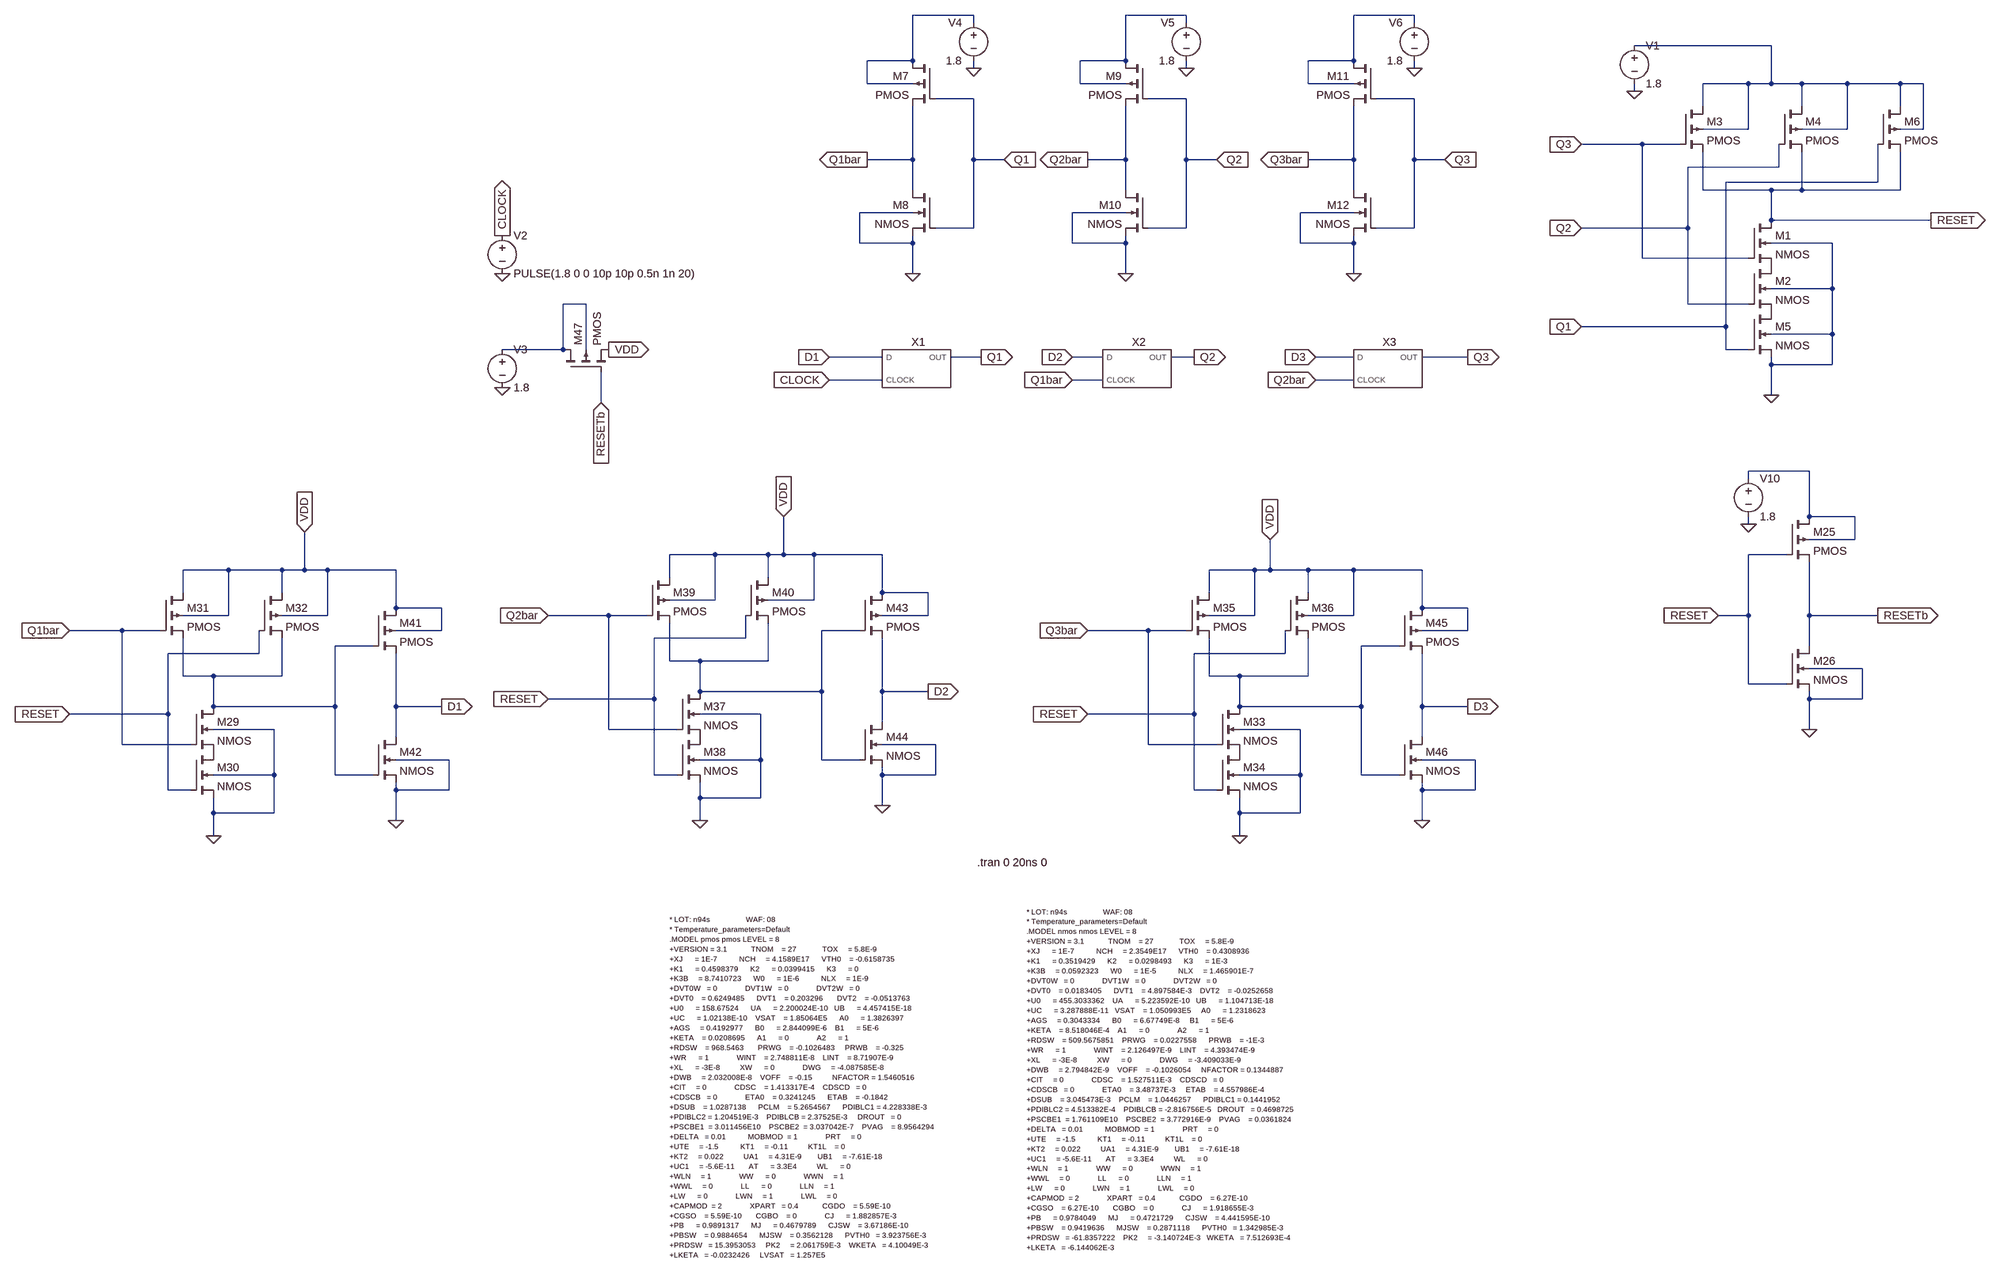
[diagram p0: schematic Mod5_Counter3.asc]
Mod5_Counter3.asc, the LTspice schematic file:
Version 4
SHEET 1 2608 2384
WIRE 16 -208 -112 -208
WIRE 464 -208 336 -208
WIRE 944 -208 816 -208
WIRE 16 -192 16 -208
WIRE 464 -192 464 -208
WIRE 944 -192 944 -208
WIRE 1792 -144 1504 -144
WIRE -112 -112 -112 -208
WIRE -112 -112 -208 -112
WIRE 336 -112 336 -208
WIRE 336 -112 240 -112
WIRE 816 -112 816 -208
WIRE 816 -112 720 -112
WIRE 16 -96 16 -112
WIRE 464 -96 464 -112
WIRE 944 -96 944 -112
WIRE -208 -64 -208 -112
WIRE -112 -64 -208 -64
WIRE 240 -64 240 -112
WIRE 336 -64 240 -64
WIRE 720 -64 720 -112
WIRE 816 -64 720 -64
WIRE 1744 -64 1648 -64
WIRE 1792 -64 1792 -144
WIRE 1792 -64 1744 -64
WIRE 1856 -64 1792 -64
WIRE 1952 -64 1856 -64
WIRE 2064 -64 1952 -64
WIRE 2112 -64 2064 -64
WIRE 1504 -48 1504 -64
WIRE 16 -32 -64 -32
WIRE 464 -32 384 -32
WIRE 944 -32 864 -32
WIRE 1648 -16 1648 -64
WIRE 1856 -16 1856 -64
WIRE 2064 -16 2064 -64
WIRE 1744 32 1744 -64
WIRE 1744 32 1648 32
WIRE 1952 32 1952 -64
WIRE 1952 32 1856 32
WIRE 2112 32 2112 -64
WIRE 2112 32 2064 32
WIRE 1520 64 1392 64
WIRE 1600 64 1520 64
WIRE -112 96 -112 -16
WIRE -112 96 -208 96
WIRE 16 96 16 -32
WIRE 80 96 16 96
WIRE 336 96 336 -16
WIRE 336 96 256 96
WIRE 464 96 464 -32
WIRE 528 96 464 96
WIRE 816 96 816 -16
WIRE 816 96 720 96
WIRE 944 96 944 -32
WIRE 1008 96 944 96
WIRE 1808 112 1808 64
WIRE 1808 112 1616 112
WIRE 2016 144 2016 64
WIRE 2016 144 1696 144
WIRE -112 160 -112 96
WIRE 336 160 336 96
WIRE 816 160 816 96
WIRE 1648 160 1648 80
WIRE 1792 160 1648 160
WIRE 1856 160 1856 80
WIRE 1856 160 1792 160
WIRE 2064 160 2064 80
WIRE 2064 160 1856 160
WIRE -112 208 -224 208
WIRE 336 208 224 208
WIRE 816 208 704 208
WIRE 1792 224 1792 160
WIRE 2128 224 1792 224
WIRE 16 240 16 96
WIRE 16 240 -64 240
WIRE 464 240 464 96
WIRE 464 240 384 240
WIRE 944 240 944 96
WIRE 944 240 864 240
WIRE 1616 240 1616 112
WIRE 1616 240 1392 240
WIRE -224 272 -224 208
WIRE -112 272 -112 256
WIRE -112 272 -224 272
WIRE 224 272 224 208
WIRE 336 272 336 256
WIRE 336 272 224 272
WIRE 704 272 704 208
WIRE 816 272 816 256
WIRE 816 272 704 272
WIRE 1920 272 1792 272
WIRE 1520 304 1520 64
WIRE 1744 304 1520 304
WIRE -112 336 -112 272
WIRE 336 336 336 272
WIRE 816 336 816 272
WIRE 1920 368 1920 272
WIRE 1920 368 1792 368
WIRE -800 400 -848 400
WIRE 1616 400 1616 240
WIRE 1744 400 1616 400
WIRE 1696 448 1696 144
WIRE 1696 448 1392 448
WIRE 1920 464 1920 368
WIRE 1920 464 1792 464
WIRE -848 496 -848 400
WIRE -848 496 -976 496
WIRE -800 496 -800 400
WIRE 1696 496 1696 448
WIRE 1744 496 1696 496
WIRE -176 512 -288 512
WIRE 32 512 -32 512
WIRE 288 512 224 512
WIRE 480 512 432 512
WIRE 816 512 736 512
WIRE 1056 512 960 512
WIRE 1792 528 1792 512
WIRE 1920 528 1920 464
WIRE 1920 528 1792 528
WIRE -176 560 -288 560
WIRE 288 560 224 560
WIRE 816 560 736 560
WIRE 1792 592 1792 528
WIRE -768 608 -768 544
WIRE 1872 752 1744 752
WIRE 1744 768 1744 752
WIRE 1872 848 1872 752
WIRE 1968 848 1872 848
WIRE 1744 864 1744 848
WIRE 1968 896 1968 848
WIRE 1968 896 1872 896
WIRE -528 928 -624 928
WIRE -416 928 -528 928
WIRE -384 928 -384 848
WIRE -384 928 -416 928
WIRE -320 928 -384 928
WIRE -176 928 -320 928
WIRE 1824 928 1744 928
WIRE -1552 960 -1648 960
WIRE -1440 960 -1552 960
WIRE -1392 960 -1392 880
WIRE -1392 960 -1440 960
WIRE -1344 960 -1392 960
WIRE -1200 960 -1344 960
WIRE 608 960 512 960
WIRE 640 960 640 896
WIRE 640 960 608 960
WIRE 720 960 640 960
WIRE 816 960 720 960
WIRE 960 960 816 960
WIRE -624 976 -624 928
WIRE -416 976 -416 928
WIRE -1648 1008 -1648 960
WIRE -1440 1008 -1440 960
WIRE -176 1008 -176 928
WIRE -80 1008 -176 1008
WIRE 512 1008 512 960
WIRE 720 1008 720 960
WIRE -528 1024 -528 928
WIRE -528 1024 -624 1024
WIRE -320 1024 -320 928
WIRE -320 1024 -416 1024
WIRE -1200 1040 -1200 960
WIRE -1104 1040 -1200 1040
WIRE 960 1040 960 960
WIRE 1056 1040 960 1040
WIRE -1552 1056 -1552 960
WIRE -1552 1056 -1648 1056
WIRE -1344 1056 -1344 960
WIRE -1344 1056 -1440 1056
WIRE -752 1056 -880 1056
WIRE -672 1056 -752 1056
WIRE -80 1056 -80 1008
WIRE -80 1056 -176 1056
WIRE 608 1056 608 960
WIRE 608 1056 512 1056
WIRE 816 1056 816 960
WIRE 816 1056 720 1056
WIRE 1744 1056 1744 928
WIRE 1744 1056 1680 1056
WIRE 1872 1056 1872 944
WIRE 2016 1056 1872 1056
WIRE -1776 1088 -1904 1088
WIRE -1696 1088 -1776 1088
WIRE -1104 1088 -1104 1040
WIRE -1104 1088 -1200 1088
WIRE -224 1088 -304 1088
WIRE 384 1088 256 1088
WIRE 464 1088 384 1088
WIRE 1056 1088 1056 1040
WIRE 1056 1088 960 1088
WIRE -464 1104 -464 1056
WIRE -464 1104 -656 1104
WIRE -1248 1120 -1328 1120
WIRE 912 1120 832 1120
WIRE 1872 1120 1872 1056
WIRE -1488 1136 -1488 1088
WIRE -1488 1136 -1680 1136
WIRE 672 1136 672 1088
WIRE 672 1136 480 1136
WIRE -624 1152 -624 1072
WIRE -560 1152 -624 1152
WIRE -416 1152 -416 1072
WIRE -416 1152 -560 1152
WIRE 1984 1168 1872 1168
WIRE -1648 1184 -1648 1104
WIRE -1584 1184 -1648 1184
WIRE -1440 1184 -1440 1104
WIRE -1440 1184 -1584 1184
WIRE 512 1184 512 1104
WIRE 576 1184 512 1184
WIRE 720 1184 720 1104
WIRE 720 1184 576 1184
WIRE 1744 1200 1744 1056
WIRE 1824 1200 1744 1200
WIRE -560 1216 -560 1152
WIRE -304 1216 -304 1088
WIRE -304 1216 -560 1216
WIRE -176 1216 -176 1104
WIRE -80 1216 -176 1216
WIRE -656 1232 -656 1104
WIRE -656 1232 -880 1232
WIRE 1872 1232 1872 1216
WIRE 1984 1232 1984 1168
WIRE 1984 1232 1872 1232
WIRE -1584 1248 -1584 1184
WIRE -1328 1248 -1328 1120
WIRE -1328 1248 -1584 1248
WIRE -1200 1248 -1200 1136
WIRE -1104 1248 -1200 1248
WIRE 576 1248 576 1184
WIRE 832 1248 832 1120
WIRE 832 1248 576 1248
WIRE 960 1248 960 1136
WIRE 1056 1248 960 1248
WIRE -1680 1264 -1680 1136
WIRE -1680 1264 -1904 1264
WIRE -432 1264 -560 1264
WIRE 480 1264 480 1136
WIRE 480 1264 256 1264
WIRE -176 1280 -176 1216
WIRE -1456 1296 -1584 1296
WIRE -752 1296 -752 1056
WIRE -608 1296 -752 1296
WIRE 704 1296 576 1296
WIRE 1872 1296 1872 1232
WIRE -1200 1312 -1200 1248
WIRE 960 1312 960 1248
WIRE -1776 1328 -1776 1088
WIRE -1632 1328 -1776 1328
WIRE -64 1328 -176 1328
WIRE 384 1328 384 1088
WIRE 528 1328 384 1328
WIRE -1088 1360 -1200 1360
WIRE -432 1360 -432 1264
WIRE -432 1360 -560 1360
WIRE -304 1360 -304 1216
WIRE -224 1360 -304 1360
WIRE 1072 1360 960 1360
WIRE -1456 1392 -1456 1296
WIRE -1456 1392 -1584 1392
WIRE -1328 1392 -1328 1248
WIRE -1248 1392 -1328 1392
WIRE -656 1392 -656 1232
WIRE -608 1392 -656 1392
WIRE -176 1392 -176 1376
WIRE -64 1392 -64 1328
WIRE -64 1392 -176 1392
WIRE 704 1392 704 1296
WIRE 704 1392 576 1392
WIRE 832 1392 832 1248
WIRE 912 1392 832 1392
WIRE -1680 1424 -1680 1264
WIRE -1632 1424 -1680 1424
WIRE -1200 1424 -1200 1408
WIRE -1088 1424 -1088 1360
WIRE -1088 1424 -1200 1424
WIRE 480 1424 480 1264
WIRE 528 1424 480 1424
WIRE 960 1424 960 1408
WIRE 1072 1424 1072 1360
WIRE 1072 1424 960 1424
WIRE -560 1440 -560 1408
WIRE -432 1440 -432 1360
WIRE -432 1440 -560 1440
WIRE -176 1456 -176 1392
WIRE -1584 1472 -1584 1440
WIRE -1456 1472 -1456 1392
WIRE -1456 1472 -1584 1472
WIRE 576 1472 576 1440
WIRE 704 1472 704 1392
WIRE 704 1472 576 1472
WIRE -1200 1488 -1200 1424
WIRE -560 1488 -560 1440
WIRE 960 1488 960 1424
WIRE -1584 1520 -1584 1472
WIRE 576 1520 576 1472
FLAG 1504 -48 0
FLAG -976 336 0
FLAG 1792 592 0
FLAG -112 336 0
FLAG 16 -96 0
FLAG 336 336 0
FLAG 464 -96 0
FLAG 816 336 0
FLAG 944 -96 0
FLAG 80 96 Q1
IOPIN 80 96 In
FLAG 528 96 Q2
IOPIN 528 96 In
FLAG 1008 96 Q3
IOPIN 1008 96 In
FLAG 1392 64 Q3
IOPIN 1392 64 In
FLAG 1392 240 Q2
IOPIN 1392 240 In
FLAG 1392 448 Q1
IOPIN 1392 448 In
FLAG 736 512 D3
IOPIN 736 512 In
FLAG 736 560 Q2bar
IOPIN 736 560 In
FLAG 224 512 D2
IOPIN 224 512 In
FLAG 224 560 Q1bar
IOPIN 224 560 In
FLAG -288 512 D1
IOPIN -288 512 In
FLAG -288 560 CLOCK
IOPIN -288 560 In
FLAG 32 512 Q1
IOPIN 32 512 Out
FLAG 480 512 Q2
IOPIN 480 512 Out
FLAG 1056 512 Q3
IOPIN 1056 512 Out
FLAG 720 96 Q3bar
IOPIN 720 96 Out
FLAG 256 96 Q2bar
IOPIN 256 96 Out
FLAG -208 96 Q1bar
IOPIN -208 96 Out
FLAG -976 256 CLOCK
IOPIN -976 256 Out
FLAG 2128 224 RESET
IOPIN 2128 224 Out
FLAG 256 1088 Q3bar
IOPIN 256 1088 In
FLAG -880 1056 Q2bar
IOPIN -880 1056 In
FLAG -1904 1088 Q1bar
IOPIN -1904 1088 In
FLAG 1872 1296 0
FLAG 1744 864 0
FLAG 1680 1056 RESET
IOPIN 1680 1056 In
FLAG 2016 1056 RESETb
IOPIN 2016 1056 Out
FLAG -976 576 0
FLAG -1584 1520 0
FLAG 576 1520 0
FLAG -560 1488 0
FLAG -1104 1248 D1
IOPIN -1104 1248 Out
FLAG -1200 1488 0
FLAG -80 1216 D2
IOPIN -80 1216 Out
FLAG -176 1456 0
FLAG 1056 1248 D3
IOPIN 1056 1248 Out
FLAG 960 1488 0
FLAG -752 496 VDD
IOPIN -752 496 Out
FLAG -1392 880 VDD
IOPIN -1392 880 In
FLAG -384 848 VDD
IOPIN -384 848 In
FLAG 640 896 VDD
IOPIN 640 896 In
FLAG -880 1232 RESET
IOPIN -880 1232 In
FLAG 256 1264 RESET
IOPIN 256 1264 In
FLAG -1904 1264 RESET
IOPIN -1904 1264 In
FLAG -768 608 RESETb
IOPIN -768 608 In
SYMBOL nmos4 1744 224 R0
SYMATTR InstName M1
SYMATTR Value2 l=180n w=1320n
SYMBOL nmos4 1744 320 R0
SYMATTR InstName M2
SYMATTR Value2 l=180n w=1320n
SYMBOL pmos4 1600 -16 R0
SYMATTR InstName M3
SYMATTR Value2 l=180n w=880n
SYMBOL pmos4 1808 -16 R0
SYMATTR InstName M4
SYMATTR Value2 l=180n w=880n
SYMBOL Voltage 1504 -160 R0
SYMATTR InstName V1
SYMATTR Value 1.8
SYMBOL Voltage -976 240 R0
SYMATTR InstName V2
SYMATTR Value PULSE(1.8 0 0 10p 10p 0.5n 1n 20)
SYMBOL nmos4 1744 416 R0
SYMATTR InstName M5
SYMATTR Value2 l=180n w=1320n
SYMBOL pmos4 2016 -16 R0
SYMATTR InstName M6
SYMATTR Value2 l=180n w=880n
SYMBOL pmos4 -64 -112 M0
SYMATTR InstName M7
SYMATTR Value2 l=180n w=880n
SYMBOL nmos4 -64 160 M0
SYMATTR InstName M8
SYMATTR Value2 l=180n w=440n
SYMBOL Voltage 16 -208 M0
SYMATTR InstName V4
SYMATTR Value 1.8
SYMBOL pmos4 384 -112 M0
SYMATTR InstName M9
SYMATTR Value2 l=180n w=880n
SYMBOL nmos4 384 160 M0
SYMATTR InstName M10
SYMATTR Value2 l=180n w=440n
SYMBOL Voltage 464 -208 M0
SYMATTR InstName V5
SYMATTR Value 1.8
SYMBOL pmos4 864 -112 M0
SYMATTR InstName M11
SYMATTR Value2 l=180n w=880n
SYMBOL nmos4 864 160 M0
SYMATTR InstName M12
SYMATTR Value2 l=180n w=440n
SYMBOL Voltage 944 -208 M0
SYMATTR InstName V6
SYMATTR Value 1.8
SYMBOL pmos4 1824 848 R0
SYMATTR InstName M25
SYMATTR Value2 l=180n w=880n
SYMBOL nmos4 1824 1120 R0
SYMATTR InstName M26
SYMATTR Value2 l=180n w=440n
SYMBOL Voltage 1744 752 R0
SYMATTR InstName V10
SYMATTR Value 1.8
SYMBOL DFF_Using_Mux -112 528 R0
SYMATTR InstName X1
SYMBOL DFF_Using_Mux 352 528 R0
SYMATTR InstName X2
SYMBOL DFF_Using_Mux 880 528 R0
SYMATTR InstName X3
SYMBOL nmos4 -1632 1248 R0
SYMATTR InstName M29
SYMATTR Value2 l=180n w=880n
SYMBOL nmos4 -1632 1344 R0
SYMATTR InstName M30
SYMATTR Value2 l=180n w=880n
SYMBOL pmos4 -1696 1008 R0
SYMATTR InstName M31
SYMATTR Value2 l=180n w=880n
SYMBOL pmos4 -1488 1008 R0
SYMATTR InstName M32
SYMATTR Value2 l=180n w=880n
SYMBOL Voltage -976 480 R0
SYMATTR InstName V3
SYMATTR Value 1.8
SYMBOL nmos4 528 1248 R0
SYMATTR InstName M33
SYMATTR Value2 l=180n w=880n
SYMBOL nmos4 528 1344 R0
SYMATTR InstName M34
SYMATTR Value2 l=180n w=880n
SYMBOL pmos4 464 1008 R0
SYMATTR InstName M35
SYMATTR Value2 l=180n w=880n
SYMBOL pmos4 672 1008 R0
SYMATTR InstName M36
SYMATTR Value2 l=180n w=880n
SYMBOL nmos4 -608 1216 R0
SYMATTR InstName M37
SYMATTR Value2 l=180n w=880n
SYMBOL nmos4 -608 1312 R0
SYMATTR InstName M38
SYMATTR Value2 l=180n w=880n
SYMBOL pmos4 -672 976 R0
SYMATTR InstName M39
SYMATTR Value2 l=180n w=880n
SYMBOL pmos4 -464 976 R0
SYMATTR InstName M40
SYMATTR Value2 l=180n w=880n
SYMBOL pmos4 -1248 1040 R0
SYMATTR InstName M41
SYMATTR Value2 l=180n w=880n
SYMBOL nmos4 -1248 1312 R0
SYMATTR InstName M42
SYMATTR Value2 l=180n w=440n
SYMBOL pmos4 -224 1008 R0
SYMATTR InstName M43
SYMATTR Value2 l=180n w=880n
SYMBOL nmos4 -224 1280 R0
SYMATTR InstName M44
SYMATTR Value2 l=180n w=440n
SYMBOL pmos4 912 1040 R0
SYMATTR InstName M45
SYMATTR Value2 l=180n w=880n
SYMBOL nmos4 912 1312 R0
SYMATTR InstName M46
SYMATTR Value2 l=180n w=440n
SYMBOL pmos4 -848 544 R270
SYMATTR InstName M47
SYMATTR Value2 l=180n w=440n
TEXT -624 1696 Left 1 !* LOT: n94s                  WAF: 08\n* Temperature_parameters=Default\n.MODEL pmos pmos LEVEL = 8\n+VERSION = 3.1            TNOM    = 27             TOX     = 5.8E-9\n+XJ      = 1E-7           NCH     = 4.1589E17      VTH0    = -0.6158735\n+K1      = 0.4598379      K2      = 0.0399415      K3      = 0\n+K3B     = 8.7410723      W0      = 1E-6           NLX     = 1E-9\n+DVT0W   = 0              DVT1W   = 0              DVT2W   = 0\n+DVT0    = 0.6249485      DVT1    = 0.203296       DVT2    = -0.0513763\n+U0      = 158.67524      UA      = 2.200024E-10   UB      = 4.457415E-18\n+UC      = 1.02138E-10    VSAT    = 1.85064E5      A0      = 1.3826397\n+AGS     = 0.4192977      B0      = 2.844099E-6    B1      = 5E-6\n+KETA    = 0.0208695      A1      = 0              A2      = 1\n+RDSW    = 968.5463       PRWG    = -0.1026483     PRWB    = -0.325\n+WR      = 1              WINT    = 2.748811E-8    LINT    = 8.71907E-9\n+XL      = -3E-8          XW      = 0              DWG     = -4.087585E-8\n+DWB     = 2.032008E-8    VOFF    = -0.15          NFACTOR = 1.5460516\n+CIT     = 0              CDSC    = 1.413317E-4    CDSCD   = 0\n+CDSCB   = 0              ETA0    = 0.3241245      ETAB    = -0.1842\n+DSUB    = 1.0287138      PCLM    = 5.2654567      PDIBLC1 = 4.228338E-3\n+PDIBLC2 = 1.204519E-3    PDIBLCB = 2.37525E-3     DROUT   = 0\n+PSCBE1  = 3.011456E10    PSCBE2  = 3.037042E-7    PVAG    = 8.9564294\n+DELTA   = 0.01           MOBMOD  = 1              PRT     = 0\n+UTE     = -1.5           KT1     = -0.11          KT1L    = 0\n+KT2     = 0.022          UA1     = 4.31E-9        UB1     = -7.61E-18\n+UC1     = -5.6E-11       AT      = 3.3E4          WL      = 0\n+WLN     = 1              WW      = 0              WWN     = 1\n+WWL     = 0              LL      = 0              LLN     = 1\n+LW      = 0              LWN     = 1              LWL     = 0\n+CAPMOD  = 2              XPART   = 0.4            CGDO    = 5.59E-10\n+CGSO    = 5.59E-10       CGBO    = 0              CJ      = 1.882857E-3\n+PB      = 0.9891317      MJ      = 0.4679789      CJSW    = 3.67186E-10\n+PBSW    = 0.9884654      MJSW    = 0.3562128      PVTH0   = 3.923756E-3\n+PRDSW   = 15.3953053     PK2     = 2.061759E-3    WKETA   = 4.10049E-3\n+LKETA   = -0.0232426     LVSAT   = 1.257E5
TEXT 128 1680 Left 1 !* LOT: n94s                  WAF: 08\n* Temperature_parameters=Default\n.MODEL nmos nmos LEVEL = 8\n+VERSION = 3.1            TNOM    = 27             TOX     = 5.8E-9\n+XJ      = 1E-7           NCH     = 2.3549E17      VTH0    = 0.4308936\n+K1      = 0.3519429      K2      = 0.0298493      K3      = 1E-3\n+K3B     = 0.0592323      W0      = 1E-5           NLX     = 1.465901E-7\n+DVT0W   = 0              DVT1W   = 0              DVT2W   = 0\n+DVT0    = 0.0183405      DVT1    = 4.897584E-3    DVT2    = -0.0252658\n+U0      = 455.3033362    UA      = 5.223592E-10   UB      = 1.104713E-18\n+UC      = 3.287888E-11   VSAT    = 1.050993E5     A0      = 1.2318623\n+AGS     = 0.3043334      B0      = 6.67749E-8     B1      = 5E-6\n+KETA    = 8.518046E-4    A1      = 0              A2      = 1\n+RDSW    = 509.5675851    PRWG    = 0.0227558      PRWB    = -1E-3\n+WR      = 1              WINT    = 2.126497E-9    LINT    = 4.393474E-9\n+XL      = -3E-8          XW      = 0              DWG     = -3.409033E-9\n+DWB     = 2.794842E-9    VOFF    = -0.1026054     NFACTOR = 0.1344887\n+CIT     = 0              CDSC    = 1.527511E-3    CDSCD   = 0\n+CDSCB   = 0              ETA0    = 3.48737E-3     ETAB    = 4.557986E-4\n+DSUB    = 3.045473E-3    PCLM    = 1.0446257      PDIBLC1 = 0.1441952\n+PDIBLC2 = 4.513382E-4    PDIBLCB = -2.816756E-5   DROUT   = 0.4698725\n+PSCBE1  = 1.761109E10    PSCBE2  = 3.772916E-9    PVAG    = 0.0361824\n+DELTA   = 0.01           MOBMOD  = 1              PRT     = 0\n+UTE     = -1.5           KT1     = -0.11          KT1L    = 0\n+KT2     = 0.022          UA1     = 4.31E-9        UB1     = -7.61E-18\n+UC1     = -5.6E-11       AT      = 3.3E4          WL      = 0\n+WLN     = 1              WW      = 0              WWN     = 1\n+WWL     = 0              LL      = 0              LLN     = 1\n+LW      = 0              LWN     = 1              LWL     = 0\n+CAPMOD  = 2              XPART   = 0.4            CGDO    = 6.27E-10\n+CGSO    = 6.27E-10       CGBO    = 0              CJ      = 1.918655E-3\n+PB      = 0.9784049      MJ      = 0.4721729      CJSW    = 4.441595E-10\n+PBSW    = 0.9419636      MJSW    = 0.2871118      PVTH0   = 1.342985E-3\n+PRDSW   = -61.8357222    PK2     = -3.140724E-3   WKETA   = 7.512693E-4\n+LKETA   = -6.144062E-3
TEXT 24 1576 Left 2 !.tran 0 20ns 0

The netlist it stands for:
* Mod5_Counter3.asc
M1 RESET Q3 P001 0 NMOS l=180n w=1320n
M2 P001 Q2 P002 0 NMOS l=180n w=1320n
M3 N004 Q3 RESET N004 PMOS l=180n w=880n
M4 N004 Q2 RESET N004 PMOS l=180n w=880n
V1 N004 0 1.8
V2 CLOCK 0 PULSE(1.8 0 0 10p 10p 0.5n 1n 20)
M5 P002 Q1 0 0 NMOS l=180n w=1320n
M6 N004 Q1 RESET N004 PMOS l=180n w=880n
M7 N001 Q1 Q1bar N001 PMOS l=180n w=880n
M8 Q1bar Q1 0 0 NMOS l=180n w=440n
V4 N001 0 1.8
M9 N002 Q2 Q2bar N002 PMOS l=180n w=880n
M10 Q2bar Q2 0 0 NMOS l=180n w=440n
V5 N002 0 1.8
M11 N003 Q3 Q3bar N003 PMOS l=180n w=880n
M12 Q3bar Q3 0 0 NMOS l=180n w=440n
V6 N003 0 1.8
M25 N006 RESET RESETb N006 PMOS l=180n w=880n
M26 RESETb RESET 0 0 NMOS l=180n w=440n
V10 N006 0 1.8
XX1 D1 CLOCK Q1 DFF_Using_Mux  ; pins D CLOCK OUT
XX2 D2 Q1bar Q2 DFF_Using_Mux  ; pins D CLOCK OUT
XX3 D3 Q2bar Q3 DFF_Using_Mux  ; pins D CLOCK OUT
M29 N008 Q1bar P003 0 NMOS l=180n w=880n
M30 P003 RESET 0 0 NMOS l=180n w=880n
M31 VDD Q1bar N008 VDD PMOS l=180n w=880n
M32 VDD RESET N008 VDD PMOS l=180n w=880n
V3 N005 0 1.8
M33 N009 Q3bar P004 0 NMOS l=180n w=880n
M34 P004 RESET 0 0 NMOS l=180n w=880n
M35 VDD Q3bar N009 VDD PMOS l=180n w=880n
M36 VDD RESET N009 VDD PMOS l=180n w=880n
M37 N007 Q2bar P005 0 NMOS l=180n w=880n
M38 P005 RESET 0 0 NMOS l=180n w=880n
M39 VDD Q2bar N007 VDD PMOS l=180n w=880n
M40 VDD RESET N007 VDD PMOS l=180n w=880n
M41 VDD N008 D1 VDD PMOS l=180n w=880n
M42 D1 N008 0 0 NMOS l=180n w=440n
M43 VDD N007 D2 VDD PMOS l=180n w=880n
M44 D2 N007 0 0 NMOS l=180n w=440n
M45 VDD N009 D3 VDD PMOS l=180n w=880n
M46 D3 N009 0 0 NMOS l=180n w=440n
M47 N005 RESETb VDD N005 PMOS l=180n w=440n
.model NMOS NMOS
.model PMOS PMOS
.lib standard.mos
* LOT: n94s                  WAF: 08
* Temperature_parameters=Default
.MODEL pmos pmos LEVEL = 8
+VERSION = 3.1            TNOM    = 27             TOX     = 5.8E-9
+XJ      = 1E-7           NCH     = 4.1589E17      VTH0    = -0.6158735
+K1      = 0.4598379      K2      = 0.0399415      K3      = 0
+K3B     = 8.7410723      W0      = 1E-6           NLX     = 1E-9
+DVT0W   = 0              DVT1W   = 0              DVT2W   = 0
+DVT0    = 0.6249485      DVT1    = 0.203296       DVT2    = -0.0513763
+U0      = 158.67524      UA      = 2.200024E-10   UB      = 4.457415E-18
+UC      = 1.02138E-10    VSAT    = 1.85064E5      A0      = 1.3826397
+AGS     = 0.4192977      B0      = 2.844099E-6    B1      = 5E-6
+KETA    = 0.0208695      A1      = 0              A2      = 1
+RDSW    = 968.5463       PRWG    = -0.1026483     PRWB    = -0.325
+WR      = 1              WINT    = 2.748811E-8    LINT    = 8.71907E-9
+XL      = -3E-8          XW      = 0              DWG     = -4.087585E-8
+DWB     = 2.032008E-8    VOFF    = -0.15          NFACTOR = 1.5460516
+CIT     = 0              CDSC    = 1.413317E-4    CDSCD   = 0
+CDSCB   = 0              ETA0    = 0.3241245      ETAB    = -0.1842
+DSUB    = 1.0287138      PCLM    = 5.2654567      PDIBLC1 = 4.228338E-3
+PDIBLC2 = 1.204519E-3    PDIBLCB = 2.37525E-3     DROUT   = 0
+PSCBE1  = 3.011456E10    PSCBE2  = 3.037042E-7    PVAG    = 8.9564294
+DELTA   = 0.01           MOBMOD  = 1              PRT     = 0
+UTE     = -1.5           KT1     = -0.11          KT1L    = 0
+KT2     = 0.022          UA1     = 4.31E-9        UB1     = -7.61E-18
+UC1     = -5.6E-11       AT      = 3.3E4          WL      = 0
+WLN     = 1              WW      = 0              WWN     = 1
+WWL     = 0              LL      = 0              LLN     = 1
+LW      = 0              LWN     = 1              LWL     = 0
+CAPMOD  = 2              XPART   = 0.4            CGDO    = 5.59E-10
+CGSO    = 5.59E-10       CGBO    = 0              CJ      = 1.882857E-3
+PB      = 0.9891317      MJ      = 0.4679789      CJSW    = 3.67186E-10
+PBSW    = 0.9884654      MJSW    = 0.3562128      PVTH0   = 3.923756E-3
+PRDSW   = 15.3953053     PK2     = 2.061759E-3    WKETA   = 4.10049E-3
+LKETA   = -0.0232426     LVSAT   = 1.257E5
* LOT: n94s                  WAF: 08
* Temperature_parameters=Default
.MODEL nmos nmos LEVEL = 8
+VERSION = 3.1            TNOM    = 27             TOX     = 5.8E-9
+XJ      = 1E-7           NCH     = 2.3549E17      VTH0    = 0.4308936
+K1      = 0.3519429      K2      = 0.0298493      K3      = 1E-3
+K3B     = 0.0592323      W0      = 1E-5           NLX     = 1.465901E-7
+DVT0W   = 0              DVT1W   = 0              DVT2W   = 0
+DVT0    = 0.0183405      DVT1    = 4.897584E-3    DVT2    = -0.0252658
+U0      = 455.3033362    UA      = 5.223592E-10   UB      = 1.104713E-18
+UC      = 3.287888E-11   VSAT    = 1.050993E5     A0      = 1.2318623
+AGS     = 0.3043334      B0      = 6.67749E-8     B1      = 5E-6
+KETA    = 8.518046E-4    A1      = 0              A2      = 1
+RDSW    = 509.5675851    PRWG    = 0.0227558      PRWB    = -1E-3
+WR      = 1              WINT    = 2.126497E-9    LINT    = 4.393474E-9
+XL      = -3E-8          XW      = 0              DWG     = -3.409033E-9
+DWB     = 2.794842E-9    VOFF    = -0.1026054     NFACTOR = 0.1344887
+CIT     = 0              CDSC    = 1.527511E-3    CDSCD   = 0
+CDSCB   = 0              ETA0    = 3.48737E-3     ETAB    = 4.557986E-4
+DSUB    = 3.045473E-3    PCLM    = 1.0446257      PDIBLC1 = 0.1441952
+PDIBLC2 = 4.513382E-4    PDIBLCB = -2.816756E-5   DROUT   = 0.4698725
+PSCBE1  = 1.761109E10    PSCBE2  = 3.772916E-9    PVAG    = 0.0361824
+DELTA   = 0.01           MOBMOD  = 1              PRT     = 0
+UTE     = -1.5           KT1     = -0.11          KT1L    = 0
+KT2     = 0.022          UA1     = 4.31E-9        UB1     = -7.61E-18
+UC1     = -5.6E-11       AT      = 3.3E4          WL      = 0
+WLN     = 1              WW      = 0              WWN     = 1
+WWL     = 0              LL      = 0              LLN     = 1
+LW      = 0              LWN     = 1              LWL     = 0
+CAPMOD  = 2              XPART   = 0.4            CGDO    = 6.27E-10
+CGSO    = 6.27E-10       CGBO    = 0              CJ      = 1.918655E-3
+PB      = 0.9784049      MJ      = 0.4721729      CJSW    = 4.441595E-10
+PBSW    = 0.9419636      MJSW    = 0.2871118      PVTH0   = 1.342985E-3
+PRDSW   = -61.8357222    PK2     = -3.140724E-3   WKETA   = 7.512693E-4
+LKETA   = -6.144062E-3
.tran 0 20ns 0
.backanno
.end